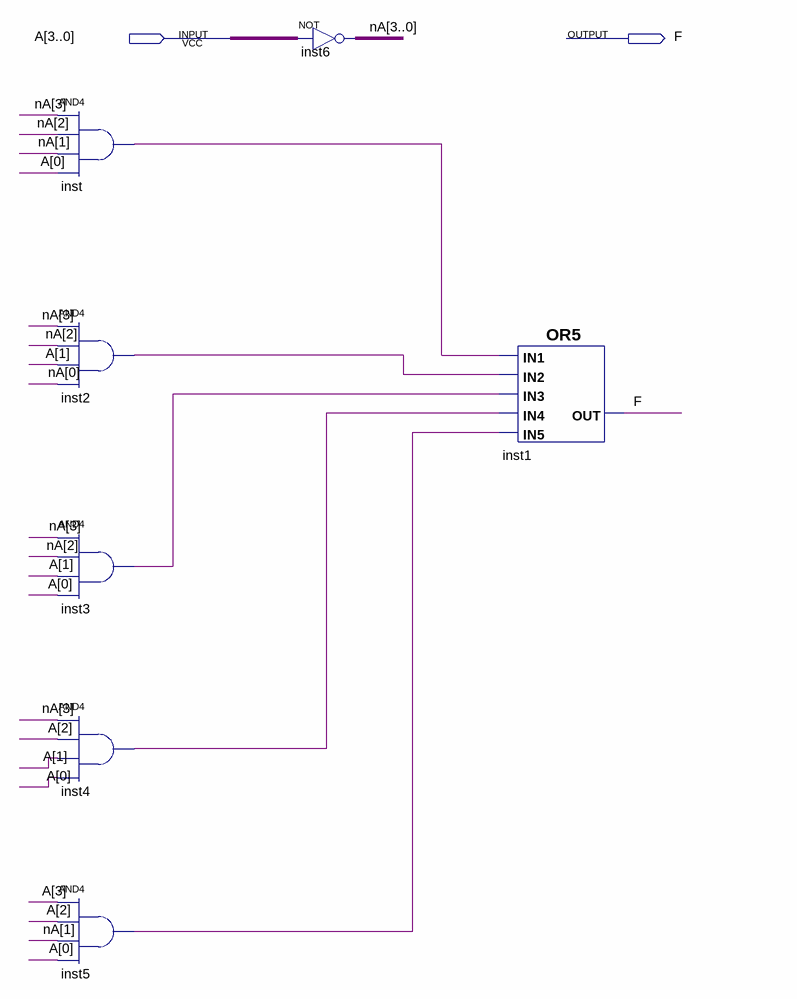
[diagram p0: schematic sheet]
// Quartus schematic F.bdf as structural Verilog: 7 symbols, 2 pins
module F (
  input  [3:0] A,
  output F
);

  wire inst2_out, inst3_out, inst4_out, inst5_out, inst_out;
  wire [3:0] nA;

  and inst (inst_out, nA[3], nA[2], nA[1], A[0]);
  and inst2 (inst2_out, nA[3], nA[2], A[1], nA[0]);
  and inst3 (inst3_out, nA[3], nA[2], A[1], A[0]);
  and inst4 (inst4_out, nA[3], A[2], A[1], A[0]);
  and inst5 (inst5_out, A[3], A[2], nA[1], A[0]);
  assign nA = ~A;  // NOT inst6, 4 bits wide
  or inst1 (F, inst_out, inst2_out, inst3_out, inst4_out, inst5_out);
endmodule
